# EAGLE design RFID_Brd_01 (EAGLE 7.2.0)
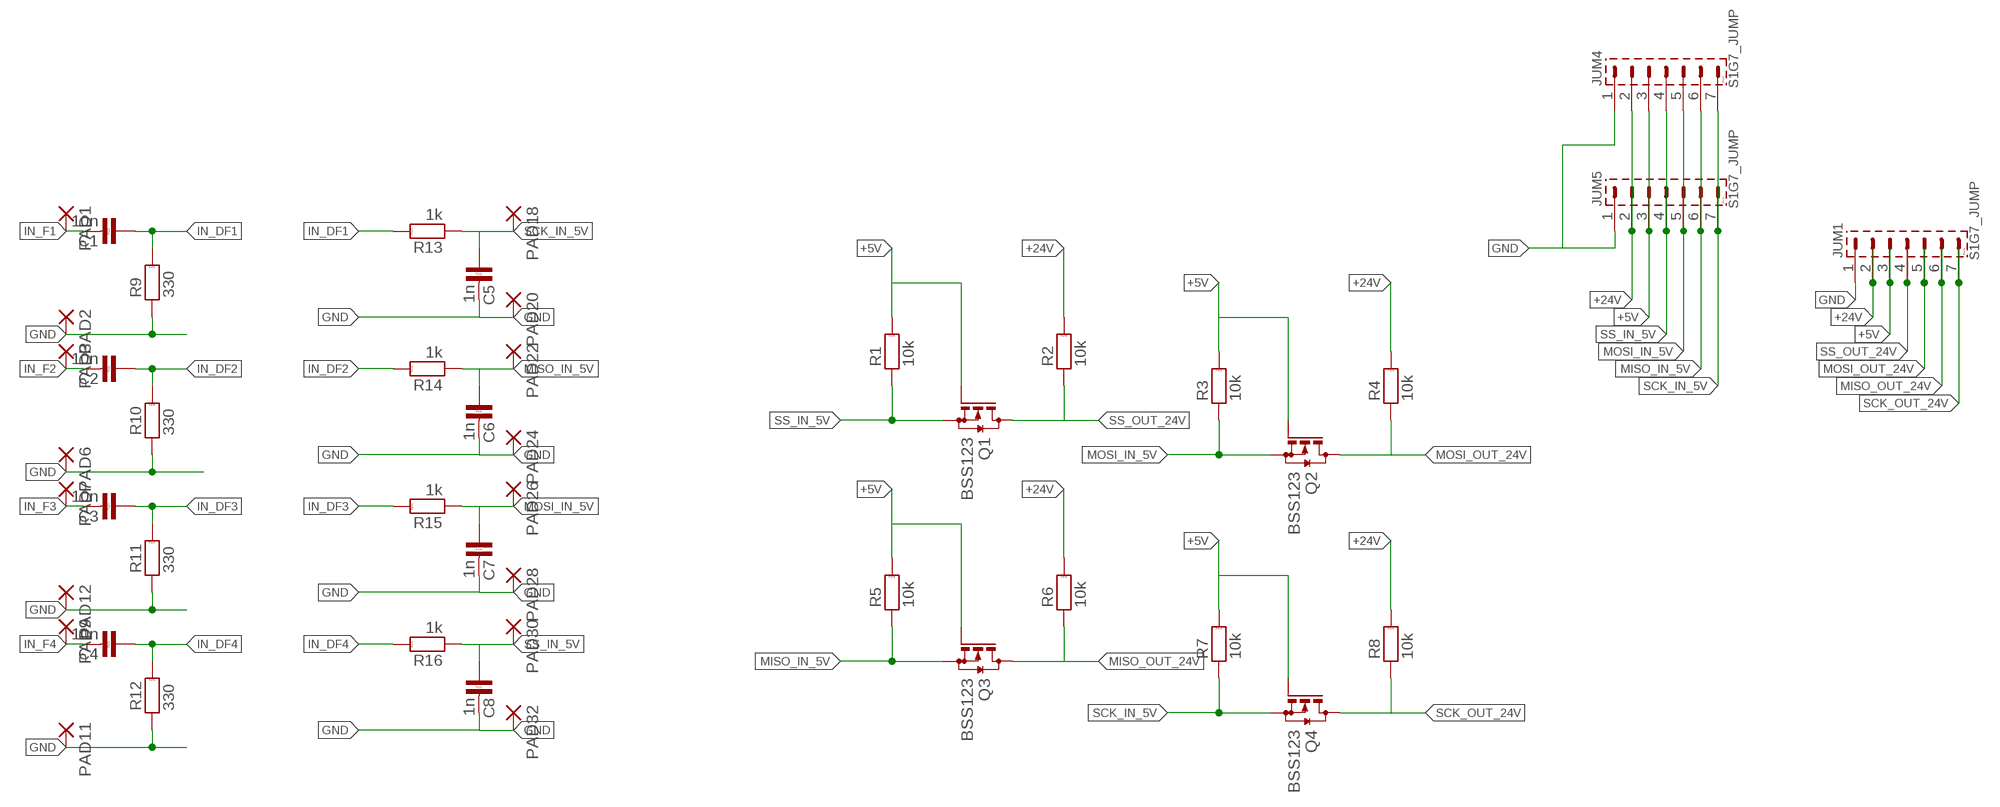
[diagram p0: schematic, sheet 1]

## Parts
C1  10n  C-KER_1206  [1206]
C2  10n  C-KER_1206  [1206]
C3  10n  C-KER_1206  [1206]
C4  10n  C-KER_1206  [1206]
C5  1n  C-KER_1206  [1206]
C6  1n  C-KER_1206  [1206]
C7  1n  C-KER_1206  [1206]
C8  1n  C-KER_1206  [1206]
JUM1  S1G7_JUMP  [S1G7_JUM]
JUM4  S1G7_JUMP  [S1G7_JUM]
JUM5  S1G7_JUMP  [S1G7_JUM]
PAD1  SMD2  [SMD1,27-2,54]
PAD2  SMD2  [SMD1,27-2,54]
PAD3  SMD2  [SMD1,27-2,54]
PAD6  SMD2  [SMD1,27-2,54]
PAD7  SMD2  [SMD1,27-2,54]
PAD9  SMD2  [SMD1,27-2,54]
PAD11  SMD2  [SMD1,27-2,54]
PAD12  SMD2  [SMD1,27-2,54]
PAD18  SMD2  [SMD1,27-2,54]
PAD20  SMD2  [SMD1,27-2,54]
PAD22  SMD2  [SMD1,27-2,54]
PAD24  SMD2  [SMD1,27-2,54]
PAD26  SMD2  [SMD1,27-2,54]
PAD28  SMD2  [SMD1,27-2,54]
PAD30  SMD2  [SMD1,27-2,54]
PAD32  SMD2  [SMD1,27-2,54]
Q1  BSS123  [SOT23]
Q2  BSS123  [SOT23]
Q3  BSS123  [SOT23]
Q4  BSS123  [SOT23]
R1  10k  R_1206  [1206]
R2  10k  R_1206  [1206]
R3  10k  R_1206  [1206]
R4  10k  R_1206  [1206]
R5  10k  R_1206  [1206]
R6  10k  R_1206  [1206]
R7  10k  R_1206  [1206]
R8  10k  R_1206  [1206]
R9  330  R_1206  [1206]
R10  330  R_1206  [1206]
R11  330  R_1206  [1206]
R12  330  R_1206  [1206]
R13  1k  R_1206  [1206]
R14  1k  R_1206  [1206]
R15  1k  R_1206  [1206]
R16  1k  R_1206  [1206]

## Nets
+5V: JUM1.3 JUM4.3 JUM5.3 Q1.1(G) Q2.1(G) Q3.1(G) Q4.1(G) R1.2 R3.2 R5.2 R7.2
+24V: JUM1.2 JUM4.2 JUM5.2 R2.2 R4.2 R6.2 R8.2
GND: C5.2 C6.2 C7.2 C8.2 JUM1.1 JUM4.1 JUM5.1 PAD2.1(P) PAD6.1(P) PAD11.1(P) PAD12.1(P) PAD20.1(P) PAD24.1(P) PAD28.1(P) PAD32.1(P) R9.1 R10.1 R11.1 R12.1
IN_DF1: C1.1 R9.2 R13.2
IN_DF2: C2.1 R10.2 R14.2
IN_DF3: C3.1 R11.2 R15.2
IN_DF4: C4.1 R12.2 R16.2
IN_F1: C1.2 PAD1.1(P)
IN_F2: C2.2 PAD3.1(P)
IN_F3: C3.2 PAD7.1(P)
IN_F4: C4.2 PAD9.1(P)
MISO_IN_5V: C6.1 JUM4.6 JUM5.6 PAD22.1(P) Q3.2(S) R5.1 R14.1
MISO_OUT_24V: JUM1.6 Q3.3(D) R6.1
MOSI_IN_5V: C7.1 JUM4.5 JUM5.5 PAD26.1(P) Q2.2(S) R3.1 R15.1
MOSI_OUT_24V: JUM1.5 Q2.3(D) R4.1
SCK_IN_5V: C5.1 JUM4.7 JUM5.7 PAD18.1(P) Q4.2(S) R7.1 R13.1
SCK_OUT_24V: JUM1.7 Q4.3(D) R8.1
SS_IN_5V: C8.1 JUM4.4 JUM5.4 PAD30.1(P) Q1.2(S) R1.1 R16.1
SS_OUT_24V: JUM1.4 Q1.3(D) R2.1

## Library data of the parts
C1-C8 = #PaJa_31:C-KER: Kondenzator - keramicky
JUM1 JUM4 JUM5 = #PaJa_konektory:S1G7_JUMP: Radove konektory - koliky - 7x
PAD1-PAD3 PAD6 PAD7 PAD9 PAD11 PAD12 PAD18 PAD20 PAD22 PAD24 PAD26 PAD28 PAD30 PAD32 = wirepad:SMD2: SMD PAD
Q1-Q4 = transistor-small-signal:BSS123: N-CHANNEL MOS FET
R1-R16 = #PaJa_31:R: Rezistor

## Board
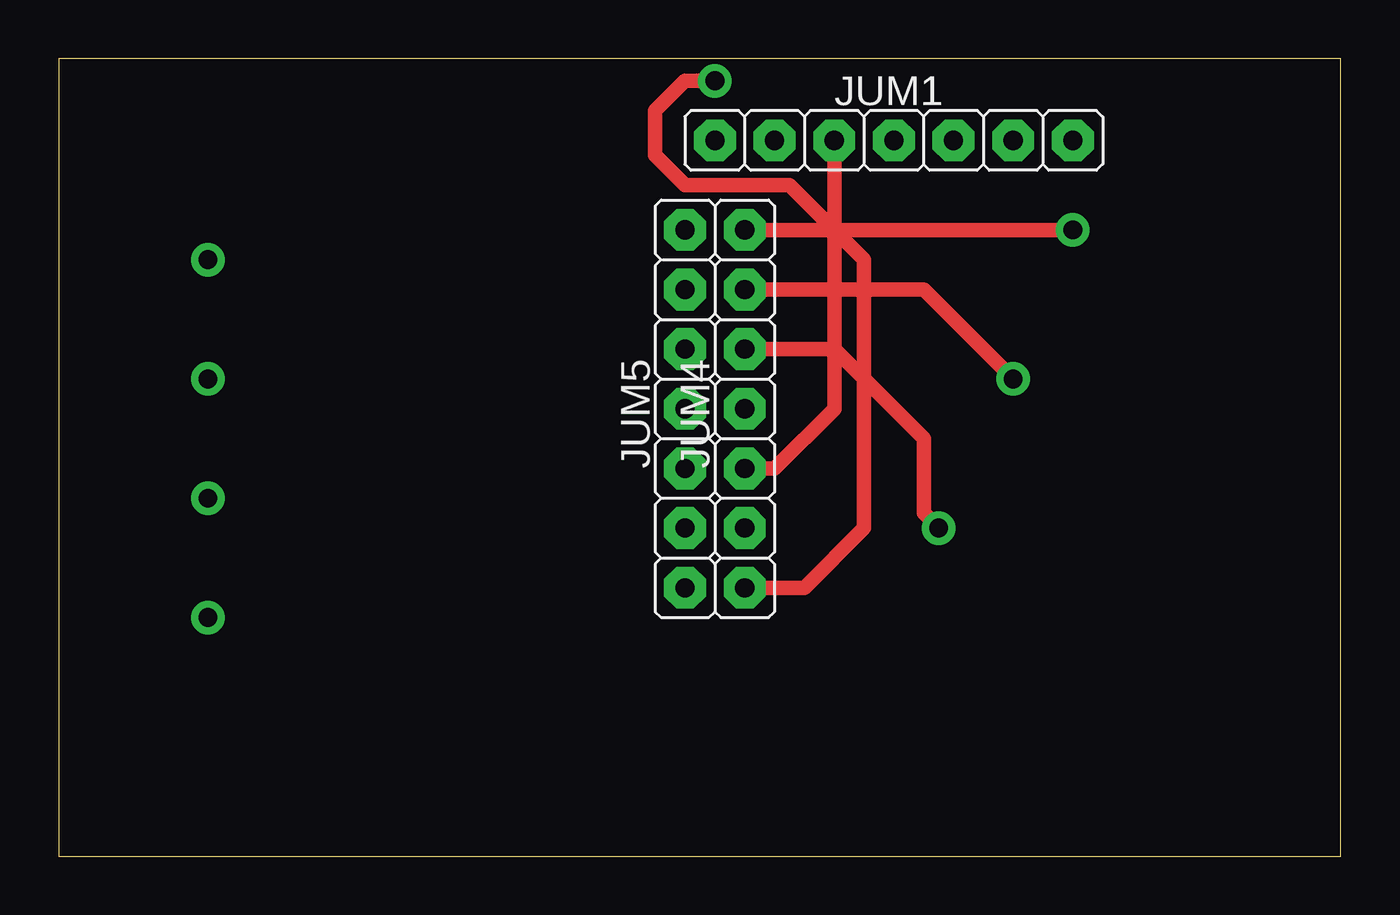
[diagram p1: board, top side]
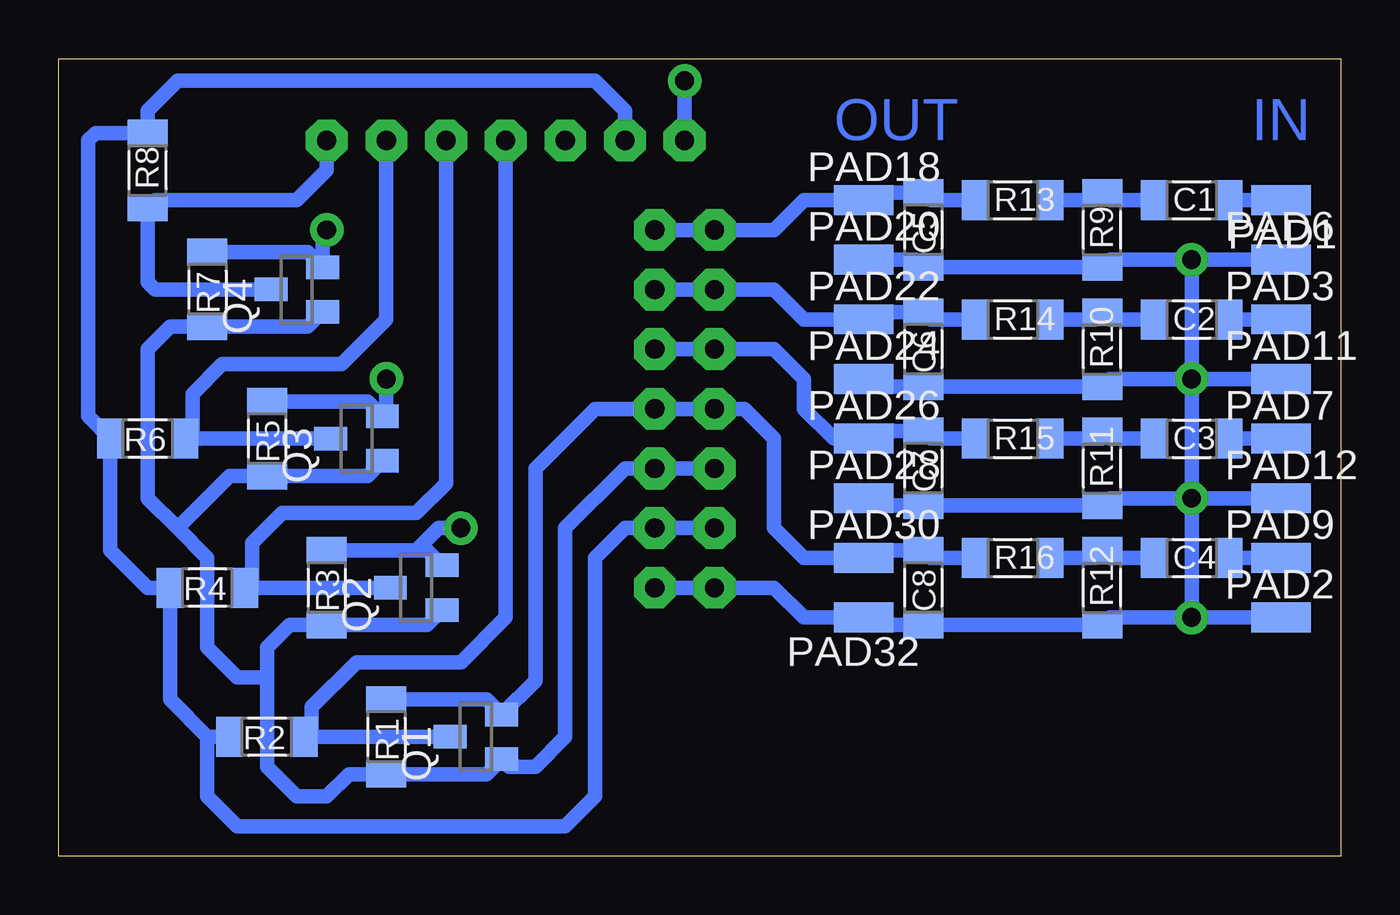
[diagram p2: board, bottom side, seen from below]

Size 54.59 x 33.96 mm. Coordinates in mm from the lower left corner, seen from the top.
Outline: 0,0 22.86,0 54.59,0 54.59,33.96 0,33.96 0,0
Copper layers (1*16): Top 0.035mm / dielectric 1.5mm / Bottom 0.035mm
Design rules "default": minimum track width 10mil, minimum drill 24mil, track to track 8mil, track to pad 8mil, pad to pad 8mil, via to via 8mil, smd to smd 8mil, copper to edge 40mil, drill to drill 8mil, minimum pad ring 10mil, minimum via ring 8mil, stop-mask expansion 4mil, vias tented up to drill 0mil, thermal gap 10mil

### Footprints (pad centres in the part's own frame; a part is rotated, then mirrored left to right if it is on the bottom)
1206 = smd 1.143 x 1.702: 1 -1.587,0; 2 1.587,0
S1G7_JUM = drill 0.813 pad 1.778 octagon: 1 -7.62,0; 2 -5.08,0; 3 -2.54,0; 4 0,0; 5 2.54,0; 6 5.08,0; 7 7.62,0
SMD1,27-2,54 = smd 1.27 x 2.54: 1 0,0
SOT23 = smd 1 x 1.4: 1 -0.95,-1.1; 2 0.95,-1.1; 3 0,1.1

### Placement (x,y rotation side)
C1  6.35,27.94 0 bottom
C2  6.35,22.86 0 bottom
C3  6.35,17.78 0 bottom
C4  6.35,12.7 0 bottom
C5  17.78,26.67 270 bottom
C6  17.78,21.59 270 bottom
C7  17.78,16.51 270 bottom
C8  17.78,11.43 270 bottom
JUM1  35.56,30.48 0 top
JUM4  29.21,19.05 90 top
JUM5  26.67,19.05 90 top
PAD1  2.54,27.94 90 bottom
PAD2  2.54,10.16 270 bottom
PAD3  2.54,22.86 270 bottom
PAD6  2.54,25.4 270 bottom
PAD7  2.54,17.78 270 bottom
PAD9  2.54,12.7 270 bottom
PAD11  2.54,20.32 270 bottom
PAD12  2.54,15.24 270 bottom
PAD18  20.32,27.94 270 bottom
PAD20  20.32,25.4 270 bottom
PAD22  20.32,22.86 270 bottom
PAD24  20.32,20.32 270 bottom
PAD26  20.32,17.78 270 bottom
PAD28  20.32,15.24 270 bottom
PAD30  20.32,12.7 270 bottom
PAD32  20.32,10.16 90 bottom
Q1  36.83,5.08 90 bottom
Q2  39.37,11.43 90 bottom
Q3  41.91,17.78 90 bottom
Q4  44.45,24.13 90 bottom
R1  40.64,5.08 270 bottom
R2  45.72,5.08 180 bottom
R3  43.18,11.43 270 bottom
R4  48.26,11.43 180 bottom
R5  45.72,17.78 270 bottom
R6  50.8,17.78 180 bottom
R7  48.26,24.13 270 bottom
R8  50.8,29.21 90 bottom
R9  10.16,26.67 90 bottom
R10  10.16,21.59 90 bottom
R11  10.16,16.51 90 bottom
R12  10.16,11.43 90 bottom
R13  13.97,27.94 0 bottom
R14  13.97,22.86 0 bottom
R15  13.97,17.78 0 bottom
R16  13.97,12.7 0 bottom

### Tracks (layer width: path | path; a pad name or v marks a point on that pad's centre or on a via)
+5V
  Top 0.61: JUM4.3 30.48,16.51 33.02,19.05 JUM1.3
  Bottom 0.61: Q4.1 43.99,22.54 R7.2 49.85,22.54 50.8,21.59 50.8,15.24 49.53,13.97 | Q3.1 41.45,16.19 R5.2 47.31,16.19 49.53,13.97 | Q2.1 38.91,9.84 R3.2 44.77,9.84 45.72,8.89 45.72,7.62 | 45.72,7.62 46.99,7.62 48.26,8.89 48.26,12.7 49.53,13.97 | 45.72,7.62 45.72,3.81 44.45,2.54 43.18,2.54 42.23,3.49 R1.2 36.37,3.49 Q1.1 35.41,3.81 34.29,3.81 33.02,5.08 33.02,13.97 30.48,16.51 JUM4.3 JUM5.3
+24V
  Bottom 0.61: 48.26,5.08 49.85,6.67 R4.2 50.8,11.43 52.39,13.02 R6.2 53.34,18.73 53.34,30.48 53.02,30.8 R8.2 50.8,31.75 49.53,33.02 31.75,33.02 30.48,31.75 JUM1.2 | 48.26,5.08 R2.2 | 48.26,5.08 48.26,2.54 46.99,1.27 33.02,1.27 31.75,2.54 31.75,12.7 30.48,13.97 JUM4.2 JUM5.2
GND  (via drill 0.8 pad 1.42)
  Top 0.61: v27.94,33.02 26.67,33.02 25.4,31.75 25.4,29.84 26.67,28.57 31.12,28.57 34.29,25.4 34.29,13.97 31.75,11.43 JUM4.1
  Bottom 0.61: PAD20.1 18.1,25.4 C5.2 17.78,25.4 17.46,25.08 R9.1 9.84,25.4 v6.35,25.4 | PAD28.1 20,14.92 C7.2 R11.1 9.84,15.24 v6.35,15.24 | PAD2.1 v6.35,10.16 | v6.35,10.16 9.84,10.16 R12.1 C8.2 20,9.84 PAD32.1 22.86,10.16 24.13,11.43 JUM5.1 JUM4.1 | PAD12.1 v6.35,15.24 | PAD11.1 v6.35,20.32 | v6.35,20.32 9.84,20.32 R10.1 C6.2 20,20 PAD24.1 | PAD6.1 v6.35,25.4 | v6.35,25.4 v6.35,20.32 | v6.35,20.32 v6.35,15.24 | v6.35,10.16 v6.35,15.24 | JUM1.1 v27.94,33.02
IN_DF1
  Bottom 0.61: C1.1 9.84,27.94 R9.2 10.48,27.94 R13.2
IN_DF2
  Bottom 0.61: R14.2 10.48,22.86 R10.2 9.84,22.86 C2.1
IN_DF3
  Bottom 0.61: C3.1 9.84,17.78 R11.2 10.16,17.78 R15.2
IN_DF4
  Bottom 0.61: C4.1 9.84,12.7 R12.2 10.48,12.7 R16.2
IN_F1
  Bottom 0.61: PAD1.1 C1.2
IN_F2
  Bottom 0.61: C2.2 PAD3.1
IN_F3
  Bottom 0.61: C3.2 PAD7.1
IN_F4
  Bottom 0.61: PAD9.1 C4.2
MISO_IN_5V  (via drill 0.8 pad 1.42)
  Top 0.61: JUM4.6 36.83,24.13 v40.64,20.32
  Bottom 0.61: R5.1 41.45,19.37 Q3.2 40.64,18.9 v40.64,20.32 | JUM4.6 JUM5.6 24.13,24.13 22.86,22.86 PAD22.1 20,23.18 C6.1 17.46,22.86 R14.1
MISO_OUT_24V
  Bottom 0.61: Q3.3 R6.1 48.89,18.1 48.89,19.68 47.62,20.95 42.55,20.95 40.64,22.86 JUM1.6
MOSI_IN_5V  (via drill 0.8 pad 1.42)
  Top 0.61: v37.47,13.97 36.83,14.61 36.83,17.78 33.02,21.59 JUM4.5
  Bottom 0.61: R3.1 39.37,13.02 | 39.37,13.02 38.91,13.02 Q2.2 | v37.47,13.97 38.42,13.97 39.37,13.02 | JUM4.5 JUM5.5 24.13,21.59 22.86,20.32 22.86,19.05 21.59,17.78 PAD26.1 20,18.1 C7.1 17.46,17.78 R15.1
MOSI_OUT_24V
  Bottom 0.61: Q2.3 R4.1 46.36,11.75 46.36,13.34 45.09,14.61 39.37,14.61 38.1,15.88 JUM1.5
SCK_IN_5V  (via drill 0.8 pad 1.42)
  Top 0.61: v43.18,26.67 JUM4.7
  Bottom 0.61: R7.1 43.99,25.72 Q4.2 43.35,26.5 v43.18,26.67 | JUM4.7 JUM5.7 24.13,26.67 22.86,27.94 PAD18.1 20,28.26 C5.1 17.46,27.94 R13.1
SCK_OUT_24V
  Bottom 0.61: Q4.3 50.48,24.13 50.8,24.45 R8.1 50.48,27.94 44.45,27.94 43.18,29.21 JUM1.7
SS_IN_5V
  Bottom 0.61: R1.1 36.37,6.67 Q1.2 34.29,7.47 34.29,16.51 31.75,19.05 JUM4.4 JUM5.4 25.4,19.05 24.13,17.78 24.13,13.97 22.86,12.7 PAD30.1 20,13.02 C8.1 17.46,12.7 R16.1
SS_OUT_24V
  Bottom 0.61: Q1.3 R2.1 43.81,5.4 43.81,6.35 41.91,8.26 37.47,8.26 35.56,10.16 JUM1.4

### Text on the board
Bottom: IN | OUT